# Altium schematic sheet 01 POWER.SchDoc
size A3; SheetNumber: 2; SheetTotal: 5
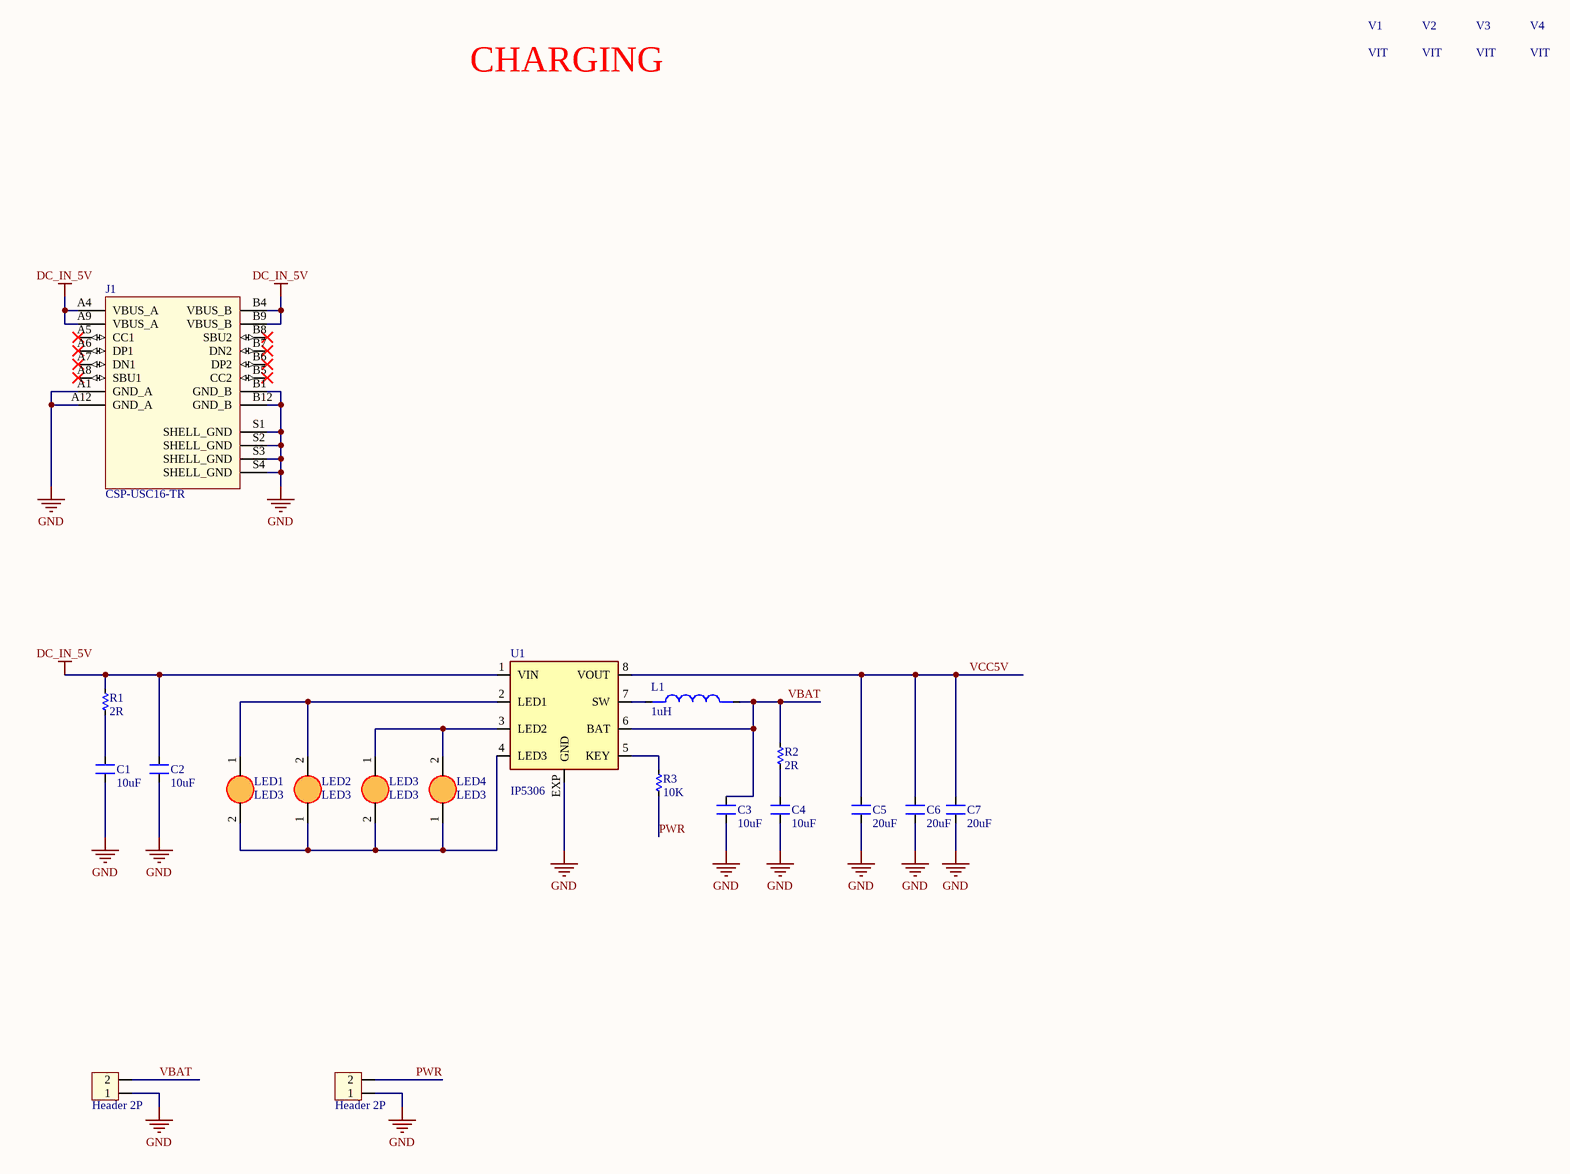
[diagram p0: 01 POWER.SchDoc]

## Parts
C1  10uF  [C 0603]
C2  10uF  [C 0603]
C3  10uF  [C 0603]
C4  10uF  [C 0603]
C5  20uF  [C 0603]
C6  20uF  [C 0603]
C7  20uF  [C 0603]
H1  Header 2P  [Header 2P DC 2.54]
H2  Header 2P  [Header 2P DC 2.54]
J1  CSP-USC16-TR  [VALCON_CSP-USC16-TR]
L1  1uH  [CUON CAM SMD 0530]
LED1  LED3  [LED3mm]
LED2  LED3  [LED3mm]
LED3  LED3  [LED3mm]
LED4  LED3  [LED3mm]
R1  2R  [RES-SMD-0603]
R2  2R  [RES-SMD-0603]
R3  10K  [RES-SMD-0603]
U1  IP5306  [SOP8-P]
V1  VIT  [VIT_01]
V2  VIT  [VIT_01]
V3  VIT  [VIT_01]
V4  VIT  [VIT_01]

## Nets
DC_IN_5V: C2.2 J1.A4(VBUS_A) J1.A9(VBUS_A) J1.B4(VBUS_B) J1.B9(VBUS_B) R1.1 U1.1(VIN)
GND: C1.1 C2.1 C3.1 C4.1 C5.1 C6.1 C7.1 H1.1 H2.1 J1.A1(GND_A) J1.A12(GND_A) J1.B1(GND_B) J1.B12(GND_B) J1.S1(SHELL_GND) J1.S2(SHELL_GND) J1.S3(SHELL_GND) J1.S4(SHELL_GND) U1.EXP(GND)
PWR: H2.2 R3.2
VBAT: C3.2 H1.2 L1.2 R2.1 U1.6(BAT)
VCC5V: C5.2 C6.2 C7.2 U1.8(VOUT)
NetC1_2: C1.2 R1.2
NetC4_2: C4.2 R2.2
NetL1_1: L1.1 U1.7(SW)
NetLED1_1: LED1.1(A) LED2.2(K) U1.2(LED1)
NetLED1_2: LED1.2(K) LED2.1(A) LED3.2(K) LED4.1(A) U1.4(LED3)
NetLED3_1: LED3.1(A) LED4.2(K) U1.3(LED2)
NetR3_1: R3.1 U1.5(KEY)

Not connected (* = marked no-connect by the designer): J1 A5(CC1)* A6(DP1)* A7(DN1)* A8(SBU1)* B5(CC2)* B6(DP2)* B7(DN2)* B8(SBU2)*

## Notes on the sheet
- CHARGING

## Library data of the parts
C1-C7 = CAP_SMD: 16V; Value: 33pF
H1 H2 = Header 2P 2.54 Duc Cong: Cắm; Ten_Linh_Kien: Header 2P XH2.54-2P Đực Cong; Don_Vi: Con; Ma_Hang: MH002852; Chung_Loai: Cắm
J1 = CSP-USC16-TR: CSP-USC16-TR Valcon USB Type C Surface Mount PCB Socket; Package: None; Purchase-URL: https://pricing.snapeda.com/search/part/CSP-USC16-TR/?ref=eda; MP: CSP-USC16-TR; Check_prices: https://www.snapeda.com/parts/CSP-USC16-TR/Valcon/view-part/4783629/?ref=eda; MF: Valcon; Value: *; Availability: No availability data; Price: None; SnapEDA_Link: https://www.snapeda.com/parts/CSP-USC16-TR/Valcon/view-part/4783629/?ref=snap
L1 = Cuon Cam SMD 0530: SMD 0530; MP: FDV0530-H-1R5M=P3; Package: None; Price: None; Value: *; Availability: Unavailable
LED1-LED4 = LED 3mm
R1-R3 = Res-SMD: RES_SMD; Manufacturer: Generic Components; Class: Passive; Published: 08/06/2000; Publisher: Altium Hobart Technology Centre
U1 = IP5306: RC (Pi) EMI Filter 2nd Order Low Pass 2 Channel R = 2.2kOhms, C = 1700pF 8-UFBGA, WLCSP; MF: NXP USA Inc.; Value: *; MP: IP5306; SnapEDA_Link: https://www.snapeda.com/parts/IP5306/NXP+Semiconductors/view-part/?ref=snap; Price: None; Package: UFBGA-8 NXP Semiconductors; Check_prices: https://www.snapeda.com/parts/IP5306/NXP+Semiconductors/view-part/?ref=eda; Availability: Not in stock
V1-V4 = VIT: VIT_3.0mm